# EAGLE schematic SBC_65C02_ISA_Discrete_v1 (EAGLE 9.2.2)
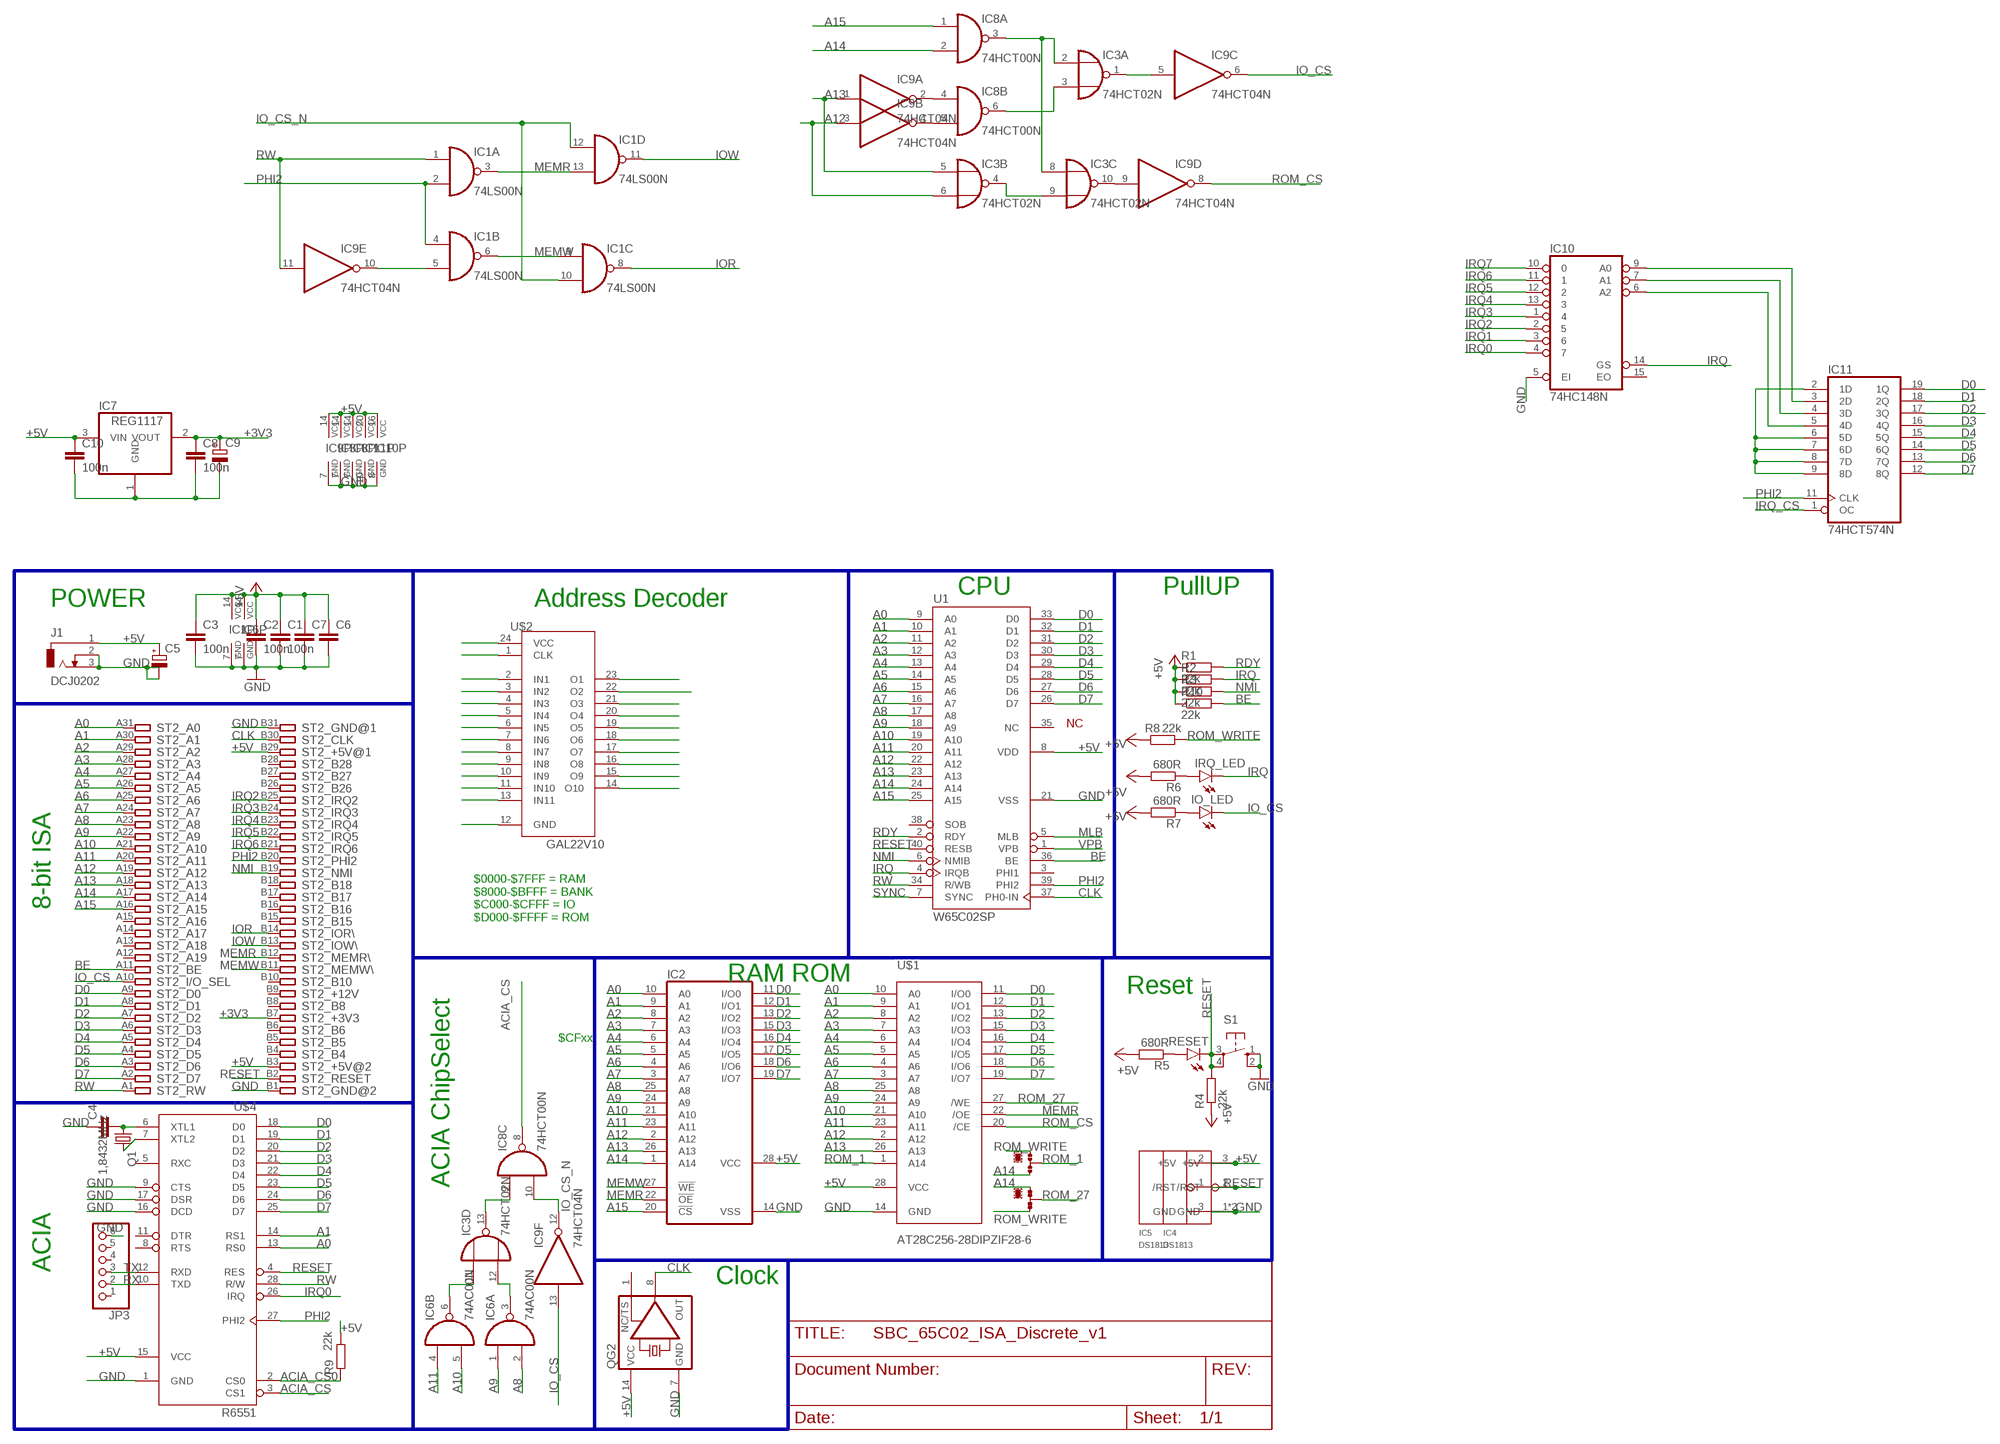
[diagram p0: schematic, sheet 1]

## Parts
C1  100n  C-EU050-025X075  [C050-025X075]
C2  100n  C-EU050-025X075  [C050-025X075]
C3  100n  C-EU050-025X075  [C050-025X075]
C4  C-EU025-030X050  [C025-030X050]
C5  CPOL-EUE3.5-8  [E3,5-8]
C6  C-EU050-035X075  [C050-035X075]
C7  C-EU050-035X075  [C050-035X075]
C8  100n  C-EU050-025X075  [C050-025X075]
C9  CPOL-EUE3.5-8  [E3,5-8]
C10  100n  C-EU050-025X075  [C050-025X075]
IC1  74LS00N  [DIL14]
IC2  62256P  [DIL28-6]
IC3  74HCT02N  [DIL14]
IC4  DS1813  DS1813SOT-223  [SOT223]
IC5  DS1813  [TO-92]
IC6  74AC00N  [DIL14]
IC7  REG1117  [SOT223]
IC8  74HCT00N  [DIL14]
IC9  74HCT04N  [DIL14]
IC10  74HC148N  [DIL16]
IC11  74HCT574N  [DIL20]
IO_LED  LED5MM  [LED5MM]
IRQ_LED  LED5MM  [LED5MM]
J1  DCJ0202  [DCJ0202]
JP3  PINHD-1X6/90  [1X06/90]
Q1  1,8432MHz  CRYSTALHC49S  [HC49/S]
QG2  XO-14  [DIL14S]
R1  22k  R-EU_0207/10  [0207/10]
R2  22k  R-EU_0207/10  [0207/10]
R3  22k  R-EU_0207/10  [0207/10]
R4  22k  R-EU_0207/10  [0207/10]
R5  680R  R-EU_0207/10  [0207/10]
R6  680R  R-EU_0207/10  [0207/10]
R7  680R  R-EU_0207/10  [0207/10]
R8  22k  R-EU_0207/10  [0207/10]
R9  22k  R-EU_0207/10  [0207/10]
R10  22k  R-EU_0207/10  [0207/10]
RESET  LED5MM  [LED5MM]
ROM_1  0R-JUMPA  [A0R-JMP]
ROM_27  0R-JUMPA  [A0R-JMP]
S1  10-XX  [B3F-10XX]
ST2  IBM8BIT_ISA  [IBM8BIT]
U1  W65C02SP  [DIP-40]
U$1  AT28C256-28DIPZIF28-6  [228-1277-00-0602J]
U$2  GAL22V10  [DIL28_1]
U$4  R6551  [DIP-28]

## Nets
+3V3: C8.1 C9.+ IC7.2(VOUT) ST2.B7
+5V [power]: C1.1 C2.1 C3.1 C5.+ C6.1 C7.1 C10.1 IC1.14(P:VCC) IC2.28(VCC) IC3.14(P:VCC) IC4.3(+5V) IC5.2(+5V) IC6.14(P:VCC) IC7.3(VIN) IC8.14(P:VCC) IC9.14(P:VCC) IC10.16(VCC) IC11.20(VCC) J1.1 QG2.14(VCC) R1.1 R2.1 R3.1 R4.1 R5.2 R6.2 R7.2 R8.1 R9.2 R10.1 ST2.B3 ST2.B29 U1.8(VDD) U$1.28(VCC) U$4.15(VCC)
A0: IC2.10(A0) ST2.A31 U1.9(A0) U$1.10(A0) U$4.13(RS0)
A1: IC2.9(A1) ST2.A30 U1.10(A1) U$1.9(A1) U$4.14(RS1)
A2: IC2.8(A2) ST2.A29 U1.11(A2) U$1.8(A2)
A3: IC2.7(A3) ST2.A28 U1.12(A3) U$1.7(A3)
A4: IC2.6(A4) ST2.A27 U1.13(A4) U$1.6(A4)
A5: IC2.5(A5) ST2.A26 U1.14(A5) U$1.5(A5)
A6: IC2.4(A6) ST2.A25 U1.15(A6) U$1.4(A6)
A7: IC2.3(A7) ST2.A24 U1.16(A7) U$1.3(A7)
A8: IC2.25(A8) IC6.2(A:I1) ST2.A23 U1.17(A8) U$1.25(A8)
A9: IC2.24(A9) IC6.1(A:I0) ST2.A22 U1.18(A9) U$1.24(A9)
A10: IC2.21(A10) IC6.5(B:I1) ST2.A21 U1.19(A10) U$1.21(A10)
A11: IC2.23(A11) IC6.4(B:I0) ST2.A20 U1.20(A11) U$1.23(A11)
A12: IC2.2(A12) IC3.6(B:I1) IC9.3(B:I) ST2.A19 U1.22(A12) U$1.2(A12)
A13: IC2.26(A13) IC3.5(B:I0) IC9.1(A:I) ST2.A18 U1.23(A13) U$1.26(A13)
A14: IC2.1(A14) IC8.2(A:I1) ROM_1.3 ROM_27.1 ST2.A17 U1.24(A14)
A15: IC2.20(!CS) IC8.1(A:I0) ST2.A16 U1.25(A15)
ACIA_CS: IC8.8(C:O) U$4.3(CS1)
ACIA_CS0: R9.1 U$4.2(CS0)
BE: R10.2 ST2.A11 U1.36(BE)
CLK: QG2.8(OUT) ST2.B30 U1.37(PH0-IN)
D0: IC2.11(I/O0) IC11.19(1Q) ST2.A9 U1.33(D0) U$1.11(I/O0) U$4.18(D0)
D1: IC2.12(I/O1) IC11.18(2Q) ST2.A8 U1.32(D1) U$1.12(I/O1) U$4.19(D1)
D2: IC2.13(I/O2) IC11.17(3Q) ST2.A7 U1.31(D2) U$1.13(I/O2) U$4.20(D2)
D3: IC2.15(I/O3) IC11.16(4Q) ST2.A6 U1.30(D3) U$1.15(I/O3) U$4.21(D3)
D4: IC2.16(I/O4) IC11.15(5Q) ST2.A5 U1.29(D4) U$1.16(I/O4) U$4.22(D4)
D5: IC2.17(I/O5) IC11.14(6Q) ST2.A4 U1.28(D5) U$1.17(I/O5) U$4.23(D5)
D6: IC2.18(I/O6) IC11.13(7Q) ST2.A3 U1.27(D6) U$1.18(I/O6) U$4.24(D6)
D7: IC2.19(I/O7) IC11.12(8Q) ST2.A2 U1.26(D7) U$1.19(I/O7) U$4.25(D7)
GND [power]: C1.2 C2.2 C3.2 C4.1 C5.- C6.2 C7.2 IC1.7(P:GND) IC2.14(VSS) IC3.7(P:GND) IC4.1(GND) IC4.4(GND) IC5.3(GND) IC6.7(P:GND) IC8.7(P:GND) IC9.7(P:GND) IC10.5(EI) IC10.8(GND) IC11.10(GND) J1.2 J1.3 JP3.6 QG2.7(GND) S1.1(S) S1.2(S1) ST2.B1 ST2.B31 U1.21(VSS) U$1.14(GND) U$4.1(GND) U$4.9(CTS) U$4.16(DCD) U$4.17(DSR)
IO_CS: IC9.6(C:O) IC9.13(F:I) IO_LED.K(C) ST2.A10
IO_CS_N: IC1.10(C:I1) IC1.12(D:I0) IC8.10(C:I1) IC9.12(F:O)
IOR: IC1.8(C:O) ST2.B14
IOW: IC1.11(D:O) ST2.B13
IRQ: IC10.14(GS) IRQ_LED.K(C) R2.2 U1.4(IRQB)
IRQ0: IC10.4 U$4.26(IRQ)
IRQ1: IC10.3
IRQ2: IC10.2 ST2.B25
IRQ3: IC10.1 ST2.B24
IRQ4: IC10.13 ST2.B23
IRQ5: IC10.12 ST2.B22
IRQ6: IC10.11 ST2.B21
IRQ7: IC10.10
IRQ_CS: IC11.1(OC)
MEMR: IC1.3(A:O) IC1.13(D:I1) IC2.22(!OE) ST2.B12 U$1.22(/OE)
MEMW: IC1.6(B:O) IC1.9(C:I0) IC2.27(!WE) ST2.B11
MLB: U1.5(MLB)
N$1: IC8.4(B:I0) IC9.2(A:O)
N$2: IRQ_LED.A R6.1
N$3: IC3.11(D:I0) IC6.6(B:O)
N$4: IC3.12(D:I1) IC6.3(A:O)
N$5: IC8.5(B:I1) IC9.4(B:O)
N$6: R5.1 RESET.A
N$7: IC3.2(A:I0) IC3.8(C:I0) IC8.3(A:O)
N$8: IC3.13(D:O) IC8.9(C:I0)
N$9: IC10.9(A0) IC11.3(2D)
N$10: IC1.5(B:I1) IC9.10(E:O)
N$11: IC10.7(A1) IC11.4(3D)
N$12: C8.2 C9.- C10.2 IC7.1(GND)
N$13: IO_LED.A R7.1
N$14: IC3.3(A:I1) IC8.6(B:O)
N$15: IC3.1(A:O) IC9.5(C:I)
N$16: IC3.4(B:O) IC3.9(C:I1)
N$17: IC3.10(C:O) IC9.9(D:I)
N$18: IC10.6(A2) IC11.5(4D)
N$19: U$2.1(CLK)
N$20: U$2.2(IN1)
N$21: U$2.3(IN2)
N$22: U$2.4(IN3)
N$23: U$2.5(IN4)
N$24: U$2.6(IN5)
N$25: IC11.2(1D) IC11.6(5D) IC11.7(6D) IC11.8(7D) IC11.9(8D)
N$26: U$2.7(IN6)
N$27: U$2.8(IN7)
N$28: U$2.9(IN8)
N$29: U$2.10(IN9)
N$30: U$2.11(IN10)
N$31: U$2.13(IN11)
N$32: U$2.12(GND)
N$33: U$2.24(VCC)
N$34: U$2.23(O1)
N$35: U$2.22(O2)
N$36: U$2.21(O3)
N$37: U$2.20(O4)
N$38: U$2.19(O5)
N$39: U$2.18(O6)
N$40: C4.2 Q1.1 U$4.6(XTL1)
N$41: Q1.2 U$4.7(XTL2)
N$42: U$2.17(O7)
N$43: U$2.16(O8)
N$44: U$2.15(O9)
N$45: U$2.14(O10)
NMI: R3.2 ST2.B19 U1.6(NMIB)
PHI2: IC1.2(A:I1) IC1.4(B:I0) IC11.11(CLK) ST2.B20 U1.39(PHI2) U$4.27(PHI2)
RDY: R1.2 U1.2(RDY)
RESET: IC4.2(/RST) IC5.1(/RST) R4.2 RESET.K(C) S1.3(P) S1.4(P1) ST2.B2 U1.40(RESB) U$4.4(RES)
ROM_1: ROM_1.2 U$1.1(A14)
ROM_27: ROM_27.2 U$1.27(/WE)
ROM_CS: IC9.8(D:O) U$1.20(/CE)
ROM_WRITE: R8.2 ROM_1.1 ROM_27.3
RW: IC1.1(A:I0) IC9.11(E:I) ST2.A1 U1.34(R/WB) U$4.28(R/W)
RX: JP3.2 U$4.10(TXD)
SYNC: U1.7(SYNC)
TX: JP3.3 U$4.12(RXD)
VPB: U1.1(VPB)
Unconnected: IC6.8(C:O) IC6.9(C:I0) IC6.10(C:I1) IC6.11(D:O) IC6.12(D:I0) IC6.13(D:I1) IC8.11(D:O) IC8.12(D:I0) IC8.13(D:I1) IC10.15(EO) JP3.1 JP3.4 JP3.5 QG2.1(TS) ST2.A12 ST2.A13 ST2.A14 ST2.A15 ST2.B4 ST2.B5 ST2.B6 ST2.B8 ST2.B9 ST2.B10 ST2.B15 ST2.B16 ST2.B17 ST2.B18 ST2.B26 ST2.B27 ST2.B28 U1.3(PHI1) U1.35(NC) U1.38(SOB) U$4.5(RXC) U$4.8(RTS) U$4.11(DTR)

## Buses
A8,A9,A10,A11,ACIA_CS,IO_CS,IO_CS_N,N$3,N$4,N$8,N$10

## Notes on the sheet
- CPU | PullUP
- POWER | Address Decoder
- 8-bit ISA
- $0000-$7FFF = RAM
  $8000-$BFFF = BANK
  $C000-$CFFF = IO
  $D000-$FFFF = ROM
- RAM ROM
- Reset
- $CFxx
- ACIA ChipSelect
- ACIA
- Clock

## Library data of the parts
C1-C3 C8 C10 = rcl:C-EU: CAPACITOR, European symbol
C4 C6 C7 = rcl:C-EU: CAPACITOR, European symbol; SPICEPREFIX: C
C5 C9 = rcl:CPOL-EU: POLARIZED CAPACITOR, European symbol; SPICEPREFIX: C
IC1 IC6 IC8 = 74xx-eu:74*00: Quad 2-input NAND gate
IC2 = memory-hitachi:62256P: MEMORY; OC_FARNELL: unknown; OC_NEWARK: unknown
IC3 = 74xx-eu:74*02: Quad 2-input NOR gate
IC4 IC5 = ds1813_revised:DS1813
IC7 = burr-brown:REG1117: 800mA and 1A Low Dropout (LDO) Positive Regulator 1.8V, 2.5V, 2.85V, 3.3V, 5V, and Adj; MPN: REG1117; OC_FARNELL: 1097566; OC_NEWARK: 14P6981
IC9 = 74xx-eu:74*04: Hex INVERTER
IC10 = 74xx-eu:74*148: 10-line to 4-line and 8-line to 3-line PRIORITY ENCODER
IC11 = 74xx-eu:74*574: 8-bit D type FLIP FLOP bus driver
IO_LED IRQ_LED RESET = led:LED: LED OSRAM: - CHIPLED LG R971, LG N971, LY N971, LG Q971, LY Q971, LO R971, LY R971 LH N974, LH R974 LS Q976, LO Q976, LY Q976 LO Q996 - Hyper CHIPLED LW Q18S LB Q993, LB Q99A, LB R99A - SideLED LS A670, LO A670, LY A670, LG A670, LP A670 LB A673, LV A673, LT A673, LW A673 LH A674 LY A675 LS A676, LA A676, LO A676, LY A676, LW A676 LS A679, LY A679, LG A679 - Hyper Micro SIDELED® LS Y876, LA Y876, LO Y876, LY Y876 LT Y87S - SmartLED LW L88C, LW L88S LB L89C, LB L89S, LG L890 LS L89K, LO L89K, LY L89K LS L896, LA L896, LO L896, LY L896 - TOPLED LS T670, LO T670, LY T670, LG T670, LP T670 LSG T670, LSP T670, LSY T670, LOP T670, LYG T670 LG T671, LOG T671, LSG T671 LB T673, LV T673, LT T673, LW T673 LH T674 LS T676, LA T676, LO T676, LY T676, LB T676, LH T676, LSB T676, LW T676 LB T67C, LV T67C, LT T67C, LS T67K, LO T67K, LY T67K, LW E67C LS E67B, LA E67B, LO E67B, LY E67B, LB E67C, LV E67C, LT E67C LW T67C LS T679, LY T679, LG T679 LS T770, LO T770, LY T770, LG T770, LP T770 LB T773, LV T773, LT T773, LW T773 LH T774 LS E675, LA E675, LY E675, LS T675 LS T776, LA T776, LO T776, LY T776, LB T776 LHGB T686 LT T68C, LB T68C - Hyper Mini TOPLED® LB M676 - Mini TOPLED Santana® LG M470 LS M47K, LO M47K, LY M47K Source: http://www.osram.convergy.de LUXEON: - LUMILED® LXK2-PW12-R00, LXK2-PW12-S00, LXK2-PW14-U00, LXK2-PW14-V00 LXK2-PM12-R00, LXK2-PM12-S00, LXK2-PM14-U00 LXK2-PE12-Q00, LXK2-PE12-R00, LXK2-PE12-S00, LXK2-PE14-T00, LXK2-PE14-U00 LXK2-PB12-K00, LXK2-PB12-L00, LXK2-PB12-M00, LXK2-PB14-N00, LXK2-PB14-P00, LXK2-PB14-Q00 LXK2-PR12-L00, LXK2-PR12-M00, LXK2-PR14-Q00, LXK2-PR14-R00 LXK2-PD12-Q00, LXK2-PD12-R00, LXK2-PD12-S00 LXK2-PH12-R00, LXK2-PH12-S00 LXK2-PL12-P00, LXK2-PL12-Q00, LXK2-PL12-R00 Source: www.luxeon.com KINGBRIGHT: KA-3528ASYC Source: www.kingbright.com
J1 = con-jack:DCJ0202: DC POWER JACK Source: DCJ0202.pdf; OC_FARNELL: unknown; OC_NEWARK: unknown
JP3 = pinhead:PINHD-1X6: PIN HEADER
Q1 = crystal:CRYSTAL: CRYSTAL; OC_FARNELL: 1667008; OC_NEWARK: unknown
QG2 = crystal:XO-: CRYSTAL; OC_FARNELL: unknown; OC_NEWARK: unknown
R1-R3 R10 = rcl:R-EU_: RESISTOR, European symbol
R4-R7 = resistor:R-EU_: RESISTOR, European symbol
R8 R9 = rcl:R-EU_: RESISTOR, European symbol; SPICEPREFIX: R
ROM_1 ROM_27 = jump-0r-smd:0R-JUMP: SMD 0R 0805 Jumper
S1 = switch-omron:10-XX: OMRON SWITCH; MPN: B3F-1000; OC_FARNELL: 176432; OC_NEWARK: 36M3542
ST2 = TiRoRiN_Libs:IBM8BIT_ISA: 8-bit CARD IBM/PC-AT
U1 = 65xxx:W65C02SP: Western Digital Version
U$1 = atmel-custom:AT28C256-28DIP: IC EEPROM 256KBIT 150NS 28DIP
U$2 = TiRoRiN_Libs:GAL22V10
U$4 = 65xxx:R6551: Rockwell R6551 ACIA Asynchronous Communiations Interface Adapter, providing UART and on-chip baud rate generator using a standard 1.8432 MHz external crystal, for speeds from 50 to 19,200 baud.

## Net classes
0 default: width 0.152 mm, drill 0.66 mm, clearance 0.254 mm
1 power: width 0.508 mm, drill 0.66 mm, clearance 0.381 mm to class 0, clearance 0.381 mm
2 data: width 0.381 mm, drill 0.66 mm, clearance 0.254 mm to class 0, clearance 0.254 mm to class 1, clearance 0.254 mm